# Altium schematic sheet 拓展板.SchDoc
size A3
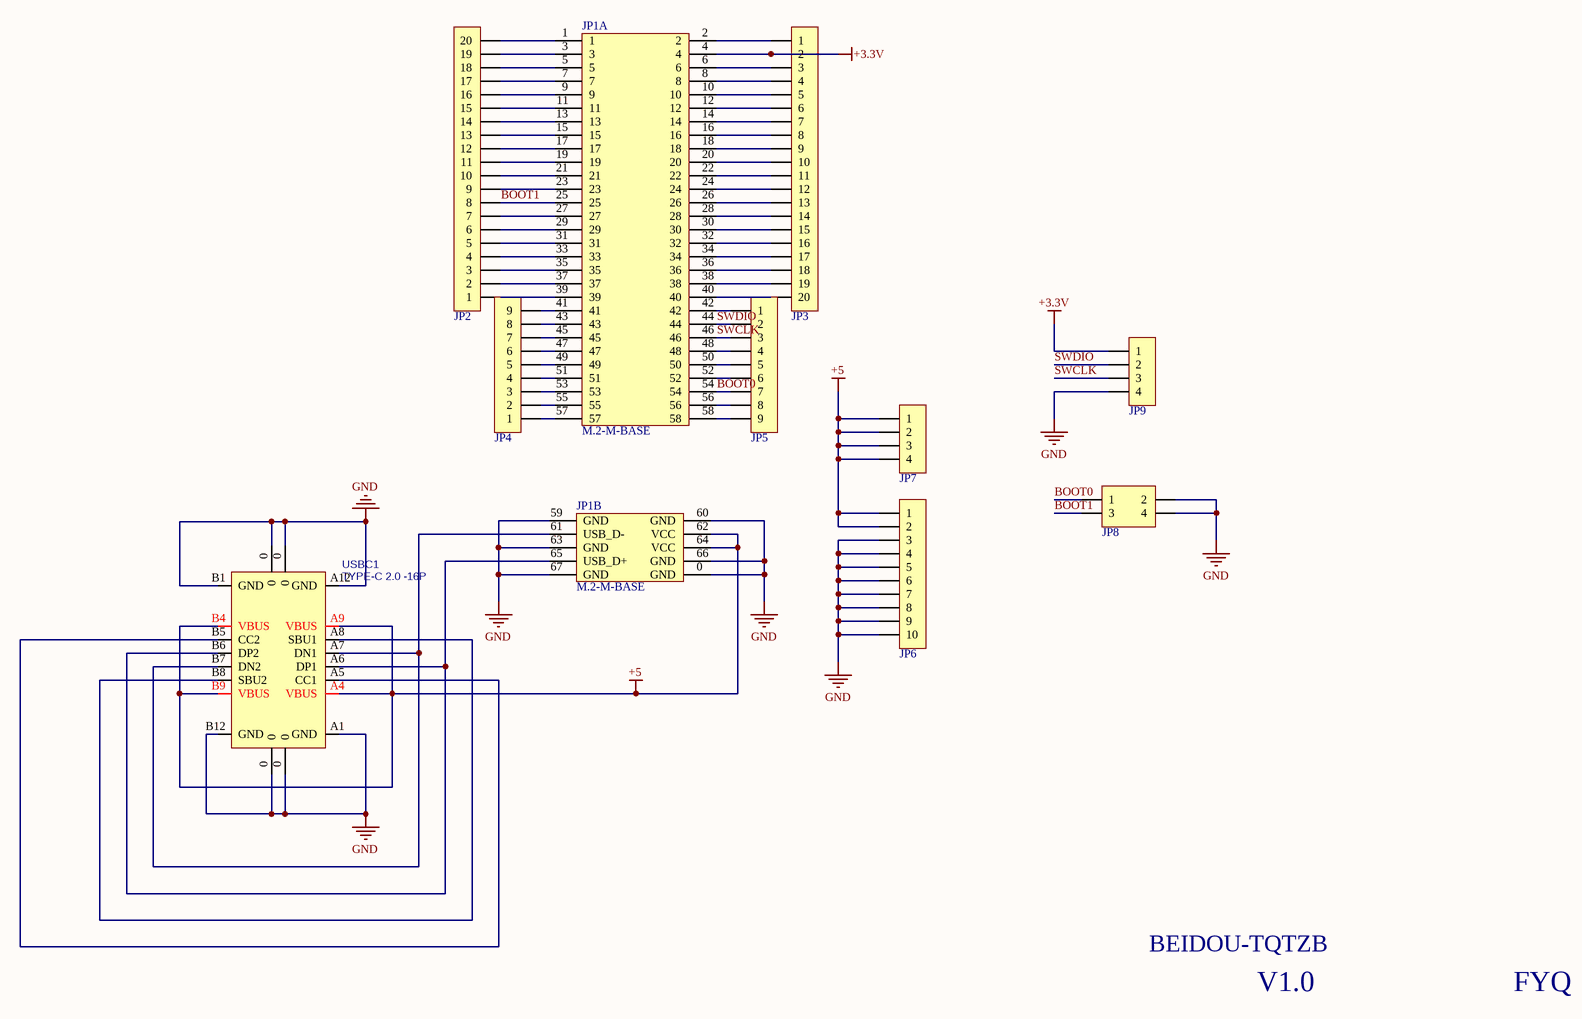
[diagram p0: 拓展板.SchDoc]

## Parts
JP1  M.2-M-BASE  [M.2-MKEY-LI-底座]  (parts A,B of 2)
JP2  HDR-1X20  [HDR2.54-LI-20P]  (value not drawn)
JP3  HDR-1X20  [HDR2.54-LI-20P]  (value not drawn)
JP4  HDR-1X9  [HDR2.54-LI-9P]  (value not drawn)
JP5  HDR-1X9  [HDR2.54-LI-9P]  (value not drawn)
JP6  HDR-1X10  [HDR2.54-LI-10P]  (value not drawn)
JP7  HDR-1X4  [HDR2.54-LI-4P]  (value not drawn)
JP8  Header2X2  [HDR2.54-LI-2x2P]  (value not drawn)
JP9  HDR-1X4  [HDR2.54-LI-4P]  (value not drawn)
USBC1  TYPE-C 2.0 -16P  [USB-C-SMD_16P]

## Nets
+3.3V: JP1.4 JP3.2 JP9.1
+5: JP1.62(VCC) JP1.64(VCC) JP6.1 JP6.2 JP7.1 JP7.2 JP7.3 JP7.4 USBC1.A4(VBUS) USBC1.A9(VBUS) USBC1.B4(VBUS) USBC1.B9(VBUS)
GND: JP1.0(GND) JP1.59(GND) JP1.60(GND) JP1.63(GND) JP1.66(GND) JP1.67(GND) JP6.3 JP6.4 JP6.5 JP6.6 JP6.7 JP6.8 JP6.9 JP6.10 JP8.2 JP8.4 JP9.4 USBC1.0 USBC1.A1(GND) USBC1.A12(GND) USBC1.B1(GND) USBC1.B12(GND)
BOOT0: JP1.54 JP5.7 JP8.1
BOOT1: JP1.25 JP2.8 JP8.3
SWCLK: JP1.46 JP5.3 JP9.3
SWDIO: JP1.44 JP5.2 JP9.2
NetJP1_1: JP1.1 JP2.20
NetJP1_2: JP1.2 JP3.1
NetJP1_3: JP1.3 JP2.19
NetJP1_5: JP1.5 JP2.18
NetJP1_6: JP1.6 JP3.3
NetJP1_7: JP1.7 JP2.17
NetJP1_8: JP1.8 JP3.4
NetJP1_9: JP1.9 JP2.16
NetJP1_10: JP1.10 JP3.5
NetJP1_11: JP1.11 JP2.15
NetJP1_12: JP1.12 JP3.6
NetJP1_13: JP1.13 JP2.14
NetJP1_14: JP1.14 JP3.7
NetJP1_15: JP1.15 JP2.13
NetJP1_16: JP1.16 JP3.8
NetJP1_17: JP1.17 JP2.12
NetJP1_18: JP1.18 JP3.9
NetJP1_19: JP1.19 JP2.11
NetJP1_20: JP1.20 JP3.10
NetJP1_21: JP1.21 JP2.10
NetJP1_22: JP1.22 JP3.11
NetJP1_23: JP1.23 JP2.9
NetJP1_24: JP1.24 JP3.12
NetJP1_26: JP1.26 JP3.13
NetJP1_27: JP1.27 JP2.7
NetJP1_28: JP1.28 JP3.14
NetJP1_29: JP1.29 JP2.6
NetJP1_30: JP1.30 JP3.15
NetJP1_31: JP1.31 JP2.5
NetJP1_32: JP1.32 JP3.16
NetJP1_33: JP1.33 JP2.4
NetJP1_34: JP1.34 JP3.17
NetJP1_35: JP1.35 JP2.3
NetJP1_36: JP1.36 JP3.18
NetJP1_37: JP1.37 JP2.2
NetJP1_38: JP1.38 JP3.19
NetJP1_39: JP1.39 JP2.1
NetJP1_40: JP1.40 JP3.20
NetJP1_41: JP1.41 JP4.9
NetJP1_42: JP1.42 JP5.1
NetJP1_43: JP1.43 JP4.8
NetJP1_45: JP1.45 JP4.7
NetJP1_47: JP1.47 JP4.6
NetJP1_48: JP1.48 JP5.4
NetJP1_49: JP1.49 JP4.5
NetJP1_50: JP1.50 JP5.5
NetJP1_51: JP1.51 JP4.4
NetJP1_52: JP1.52 JP5.6
NetJP1_53: JP1.53 JP4.3
NetJP1_55: JP1.55 JP4.2
NetJP1_56: JP1.56 JP5.8
NetJP1_57: JP1.57 JP4.1
NetJP1_58: JP1.58 JP5.9
NetJP1_61: JP1.61(USB_D-) USBC1.A7(DN1) USBC1.B7(DN2)
NetJP1_65: JP1.65(USB_D+) USBC1.A6(DP1) USBC1.B6(DP2)
NetUSBC1_A5: USBC1.A5(CC1) USBC1.B5(CC2)
NetUSBC1_A8: USBC1.A8(SBU1) USBC1.B8(SBU2)

## Notes on the sheet
- BEIDOU-TQTZB
- V1.0
- FYQ

## Library data of the parts
JP1 = M.2-M底座
JP2 JP3 = Header 20: 20P接插件; 封装库来自淘宝卖家 ID：黄晶宝石: 其他店铺购入均为盗版假冒封装库; 联系卖家，免费查找封装: 唯一出售店铺网址https://shop463601444.taobao.com; BOM名称: 20P接插件
JP4 JP5 = Header 9: 9P接插件; 封装库来自淘宝卖家 ID：黄晶宝石: 其他店铺购入均为盗版假冒封装库; 联系卖家，免费查找封装: 唯一出售店铺网址https://shop463601444.taobao.com; BOM名称: 9P接插件
JP6 = Header 10: 10P接插件; 封装库来自淘宝卖家 ID：黄晶宝石: 其他店铺购入均为盗版假冒封装库; 联系卖家，免费查找封装: 唯一出售店铺网址https://shop463601444.taobao.com; BOM名称: 10P接插件
JP7 JP9 = Header 4: 4P接插件; 封装库来自淘宝卖家 ID：黄晶宝石: 其他店铺购入均为盗版假冒封装库; 联系卖家，免费查找封装: 唯一出售店铺网址https://shop463601444.taobao.com; BOM名称: 4P接插件
JP8 = Header 2X2: 2*2P接插件; 封装库来自淘宝卖家 ID：黄晶宝石: 其他店铺购入均为盗版假冒封装库; 联系卖家，免费查找封装: 唯一出售店铺网址https://shop463601444.taobao.com; BOM名称: 2*2P接插件
USBC1 = USB2.0_Type-C_16Pin: USB2.0 Type-C 16Pin  母座; 联系卖家，免费技术支持: 唯一出售店铺网址https://shop463601444.taobao.com